# EAGLE design PCB-SLIDER60_v11-16 (EAGLE 7.7.0)
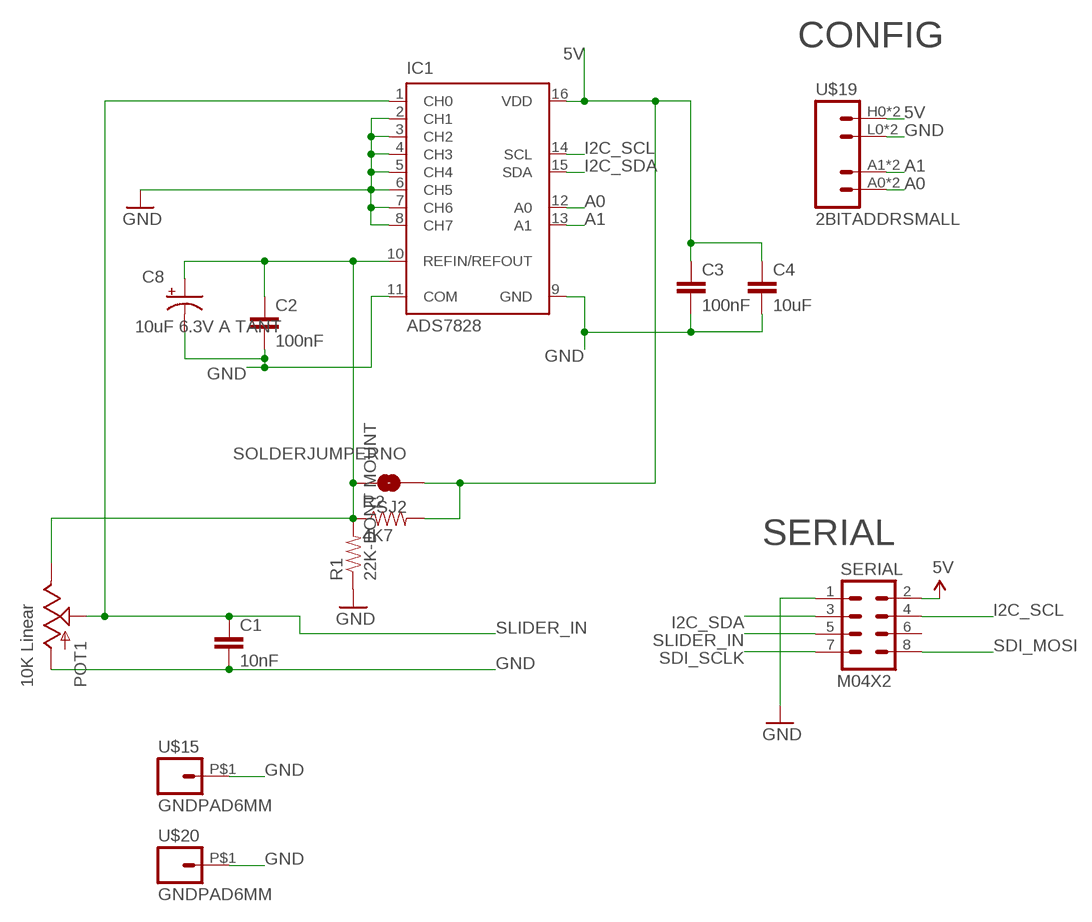
[diagram p0: schematic, sheet 1]

## Parts
C1  10nF  CAP0603-CAP  [0603-CAP]
C2  100nF  CAP0603-CAP  [0603-CAP]
C3  100nF  CAP0603-CAP  [0603-CAP]
C4  10uF  CAP0805  [0805]
C8  10uF 6.3V A TANT  CAP_POL1206  [EIA3216]
IC1  ADS7828  [TSSOP16-PW]
POT1  10K Linear  SLIDER60  [SLIDER60]
R1  22K-DONT MOUNT  RESISTOR0603-RES  [0603-RES]
R2  4K7  RESISTOR0603-RES  [0603-RES]
SERIAL  M04X2  [2X4]
SJ2  SOLDERJUMPERNO  [SJ_2S-NO]
U$15  GNDPAD6MM  [3.2MMPAD6MM]
U$19  2BITADDRSMALL  [2BITADDR_SMALL]
U$20  GNDPAD6MM  [3.2MMPAD6MM]

## Nets
5V [Power]: C3.1 C4.1 IC1.16(VDD) R2.2 SERIAL.2 SJ2.1 U$19.H0(VCC) U$19.H1(VCC)
A0: IC1.12(A0) U$19.A0(A1) U$19.AS0(A1)
A1: IC1.13(A1) U$19.A1(A2) U$19.AS1(A2)
GND [Power]: C1.2 C2.2 C3.2 C4.2 C8.C(-) IC1.2(CH1) IC1.3(CH2) IC1.4(CH3) IC1.5(CH4) IC1.6(CH5) IC1.7(CH6) IC1.8(CH7) IC1.9(GND) IC1.11(COM) POT1.3(A) R1.1 SERIAL.1 U$15.P$1 U$19.L0(GND) U$19.L1(GND) U$20.P$1
I2C_SCL: IC1.14(SCL) SERIAL.4
I2C_SDA: IC1.15(SDA) SERIAL.3
N$1: C2.1 C8.A(+) IC1.10(REFIN/REFOUT) POT1.1(E) R1.2 R2.1 SJ2.2
SDI_MOSI: SERIAL.8
SDI_SCLK: SERIAL.7
SLIDER_IN: C1.1 IC1.1(CH0) POT1.2A(S) SERIAL.5
Unconnected: SERIAL.6

## Notes on the sheet
- CONFIG
- SERIAL

## Library data of the parts
C1-C4 = SparkFun:CAP: Capacitor Standard 0603 ceramic capacitor, and 0.1" leaded capacitor.
C8 = freetronics:CAP_POL: Capacitor Polarized These are standard SMD and PTH capacitors. Normally 10uF, 47uF, and 100uF in electrolytic and tantalum varieties. Always verify the external diameter of the through hole cap, it varies with capacity, voltage, and manufacturer. The EIA devices should be standard.
IC1 = burr-brown:ADS7828: 12-Bit, 8-Channel Sampling ANALOG-TO-DIGITAL CONVERTER with I2C? Interface Source: www.ti.com .. ADS7828.pdf; MF: TEXAS INSTRUMENTS; MPN: ADS7828E/250; OC_FARNELL: 1470338; OC_NEWARK: 74C7158
POT1 = SKAARHOJ:SLIDER
R1 R2 = SparkFun:RESISTOR: Resistor Basic schematic elements and footprints for 0603, 1206, and PTH resistors.
SERIAL = SparkFun:M04X2
SJ2 = SparkFun:SOLDERJUMPER: Solder Jumper Standard SMD solder jumper. Used to automate production. Two varients : Normally Open and Normally Closed are the same, but have different paste layers. NC will have a large amount of paste and should jumper during reflow.
U$15 U$20 = SKAARHOJ:GNDPAD
U$19 = SKAARHOJ:2BITADDR

## Net classes
0 default: width 0.203 mm, drill 0.406 mm, clearance 0.203 mm
1 Power: width 0.406 mm, drill 0.61 mm, clearance 0.203 mm

## Board
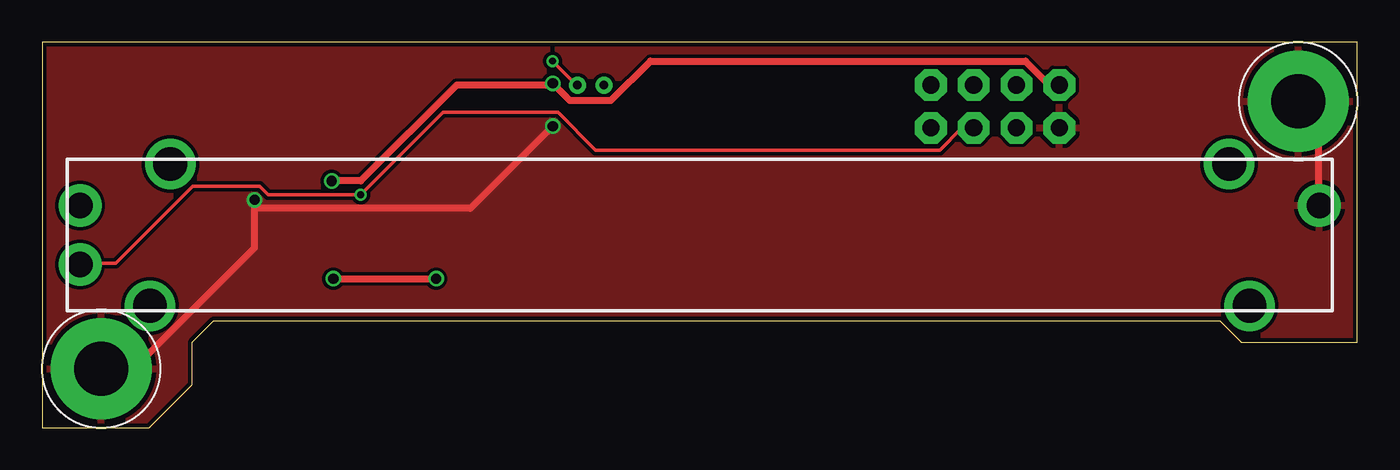
[diagram p1: board, top side]
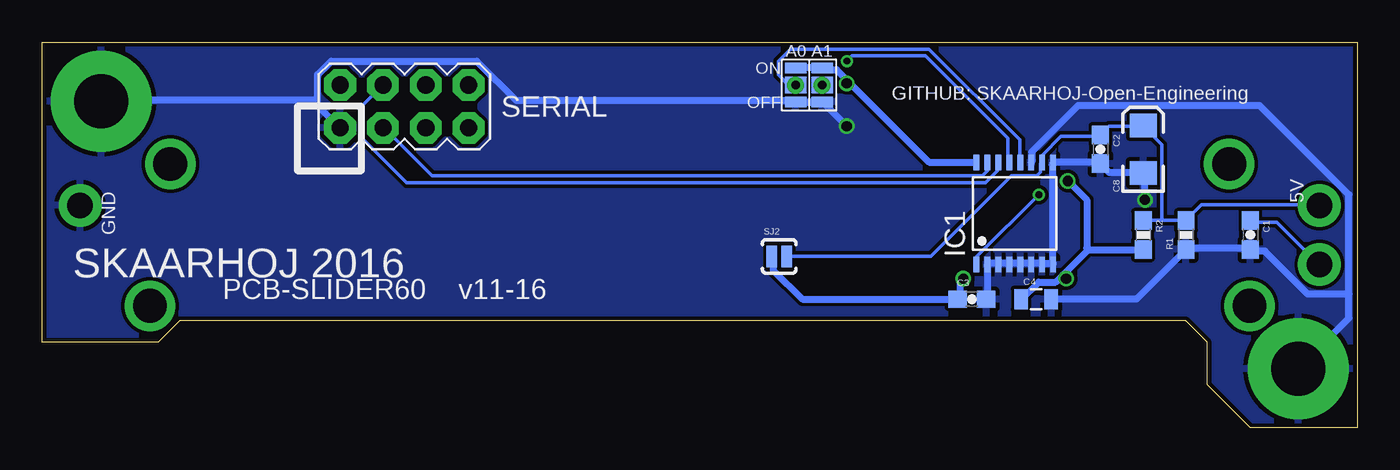
[diagram p2: board, bottom side, seen from below]

Size 78 x 22.86 mm. Coordinates in mm from the lower left corner, seen from the top.
Outline: 0,0 6.35,0 8.89,2.54 8.89,5.08 10.16,6.35 69.85,6.35 71.12,5.08 78,5.08 78,22.86 0,22.86 0,0
Copper layers (1*16): Top 0.035mm / dielectric 1.5mm / Bottom 0.035mm
Design rules "Fusion_eagle_rule_v1.1": minimum track width 6mil, minimum drill 12mil, track to track 6mil, track to pad 6mil, pad to pad 6mil, via to via 6mil, smd to smd 0mil, copper to edge 10mil, drill to drill 10mil, minimum pad ring 10mil, minimum via ring 6mil, stop-mask expansion 2mil, vias tented up to drill 100mil, thermal gap 10mil

### Footprints (pad centres in the part's own frame; a part is rotated, then mirrored left to right if it is on the bottom)
0603-CAP = smd 1.1 x 1: 1 -0.85,0; 2 0.85,0
0805 = smd 0.8 x 1.2: 1 -0.9,0; 2 0.9,0
EIA3216 = smd 1.4 x 1.6: A 1.4,0; C -1.4,0
TSSOP16-PW = smd 0.35 x 0.9: 1 -2.275,-3.025; 2 -1.625,-3.025; 3 -0.975,-3.025; 4 -0.325,-3.025; 5 0.325,-3.025; 6 0.975,-3.025; 7 1.625,-3.025; 8 2.275,-3.025; 9 2.275,3.025; 10 1.625,3.025; 11 0.975,3.025; 12 0.325,3.025; 13 -0.325,3.025; 14 -0.975,3.025; 15 -1.625,3.025; 16 -2.275,3.025
SLIDER60 = drill 1.5 pad 2.54: 1 -36.75,1.75; 2A -36.75,-1.75; 3 36.75,1.75 | drill 2: P$1 -31.4,4.2; P$2 31.4,4.2; P$3 32.6,-4.2; P$4 -32.6,-4.2
0603-RES = smd 1.1 x 1: 1 -0.85,0; 2 0.85,0
2X4 = drill 1.016 pad 1.88 octagon: 1 -3.81,-1.27; 2 -3.81,1.27; 3 -1.27,-1.27; 4 -1.27,1.27; 5 1.27,-1.27; 6 1.27,1.27; 7 3.81,-1.27; 8 3.81,1.27
SJ_2S-NO = smd 0.635 x 1.27: 1 -0.45,0; 2 0.45,0
3.2MMPAD6MM = drill 3.2 pad 6: P$1 0,0
2BITADDR_SMALL = drill 0.5: A0 -1.565,0; A1 0,0 | smd 1.27 x 1: AS0 -1.565,0; AS1 0,0 | smd 1.27 x 0.635: H0 -1.565,1; H1 0,1; L0 -1.565,-1; L1 0,-1

### Placement (x,y rotation side)
C1  6.35,11.43 270 bottom
C2  15.24,16.51 270 bottom
C3  22.86,7.62 0 bottom
C4  19.05,7.62 0 bottom
C8  12.7,16.51 90 bottom
IC1  20.32,12.7 0 bottom
POT1  39,11.43 0 top
R1  10.16,11.43 90 bottom
R2  12.7,11.43 270 bottom
SERIAL  56.52,19.05 0 bottom
SJ2  34.29,10.16 0 bottom
U$15  3.5,3.5 0 top
U$19  31.75,20.32 0 bottom
U$20  74.5,19.36 0 top

### Tracks (layer width: path | path; a pad name or v marks a point on that pad's centre or on a via)
5V  (via drill 0.61)
  Top 0.406: SERIAL.2 59.74,20.32 58.32,21.74 36.07,21.74 33.73,19.41 31.29,19.41 v30.28,20.42 30.18,20.32 24.59,20.32 18.9,14.63 v17.17,14.63 | v17.27,8.84 v23.37,8.84
  Bottom 0.406: SJ2.1 34.65,10.16 34.65,9.35 32.92,7.62 C3.1 23.57,7.72 23.57,8.64 v23.37,8.84 | 15.95,10.57 12.7,10.57 R2.2 | 17.48,9.04 17.88,8.64 18.9,8.64 19.91,7.62 C4.1 | 17.48,9.04 15.95,10.57 | 30.18,20.52 30.89,21.23 31.7,21.23 U$19.H1 31.9,21.34 33.22,21.34 U$19.H0 | 30.18,20.52 25.4,15.75 22.66,15.75 IC1.16 | v30.28,20.42 30.18,20.52 | v17.17,14.63 16.05,13.51 16.05,10.67 15.95,10.57 | v17.27,8.84 17.48,9.04
A0
  Bottom 0.203: IC1.12 20.02,15.75 20.02,17.07 25.4,22.45 33.63,22.45 34.34,21.74 34.34,20.93 33.73,20.32 33.33,20.32 U$19.AS0
A1  (via drill 0.41)
  Top 0.203: v30.28,21.74 31.7,20.32 U$19.A1
  Bottom 0.203: v30.28,21.74 29.97,22.05 25.6,22.05 20.73,17.17 20.73,15.75 IC1.13 | 31.8,20.32 U$19.A1
GND  (via drill 0.61)
  Top 0.406: 12.6,13.01 12.6,10.67 5.49,3.56 3.56,3.56 U$15.P$1 | 12.6,13.01 v12.6,13.51 | POT1.3 75.69,13.21 75.69,18.19 74.57,19.3 U$20.P$1 | 12.6,13.01 25.4,13.01 v30.28,17.88
  Bottom 0.406: 18.69,9.75 18.09,9.75 IC1.8 18.09,9.96 18.09,15.54 IC1.9 17.98,15.75 15.24,15.75 C2.2 15.14,15.54 14.73,15.14 12.7,15.14 C8.C 12.6,14.94 v12.6,13.51 | 18.69,9.75 IC1.7 | 18.69,9.75 18.9,9.75 19.3,9.75 IC1.6 19.51,9.75 19.91,9.75 IC1.5 20.12,9.75 20.62,9.75 20.64,9.71 | 20.64,9.71 IC1.4 | 20.64,9.71 20.83,9.75 21.23,9.75 IC1.3 21.44,9.75 21.84,9.75 IC1.2 21.95,9.55 21.95,7.62 C3.2 | C4.2 13.11,7.62 10.26,10.46 R1.1 10.16,10.67 6.4,10.67 C1.2 6.2,10.46 5.49,10.46 2.95,7.92 0.51,7.92 | 0.51,7.92 0.51,6.5 3.45,3.56 U$15.P$1 | 0.51,7.92 0.51,13.82 5.79,19.1 16.56,19.1 19.3,16.36 19.3,15.75 IC1.11 | 61.67,19.41 61.67,19.1 60.35,17.78 SERIAL.1 | 61.67,19.41 61.67,20.93 60.86,21.74 52.22,21.74 49.89,19.41 33.43,19.41 U$19.L0 33.22,19.3 31.8,19.3 U$19.L1 31.6,19.2 v30.28,17.88 | 61.67,19.41 74.47,19.41 U$20.P$1
  pour Top: 0,0 78.74,0 78.74,22.86 0,22.86
  pour Bottom: 0,0 78.74,0 78.74,22.86 0,22.86
I2C_SCL
  Bottom 0.203: IC1.14 21.34,15.65 21.34,15.24 22.05,14.53 56.39,14.53 59.03,17.17 59.03,19.1 57.81,20.32 SERIAL.4
I2C_SDA
  Bottom 0.203: IC1.15 21.95,15.65 21.95,15.24 22.25,14.94 54.86,14.94 57.71,17.78 SERIAL.3
N$1
  Bottom 0.203: 11.58,12.29 12.7,12.29 R2.1 | 11.58,12.29 10.16,12.29 | SJ2.2 25.3,10.16 20.52,14.94 19,14.94 18.8,15.14 18.8,15.65 IC1.10 18.69,15.75 18.69,16.15 17.58,17.27 15.24,17.27 C2.1 15.24,17.37 14.73,17.88 12.7,17.88 | 11.58,12.29 11.58,16.76 12.7,17.88 | 12.7,17.88 C8.A | 10.16,12.29 9.25,13.21 2.34,13.21 POT1.1 | 10.16,12.29 R1.2
SLIDER_IN  (via drill 0.41)
  Top 0.203: POT1.2A 2.34,9.75 4.37,9.75 8.94,14.33 12.9,14.33 13.41,13.82 v18.9,13.82 23.77,18.69 30.58,18.69 32.82,16.46 53.24,16.46 54.56,17.78 SERIAL.5
  Bottom 0.203: v18.9,13.82 22.55,10.16 22.55,9.75 IC1.1 | C1.1 6.3,12.19 4.78,12.19 2.34,9.75 POT1.2A

### Text on the board
_bsilk: GITHUB: SKAARHOJ-Open-Engineering | 5V | GND | SKAARHOJ 2016 | PCB-SLIDER60 v11-16